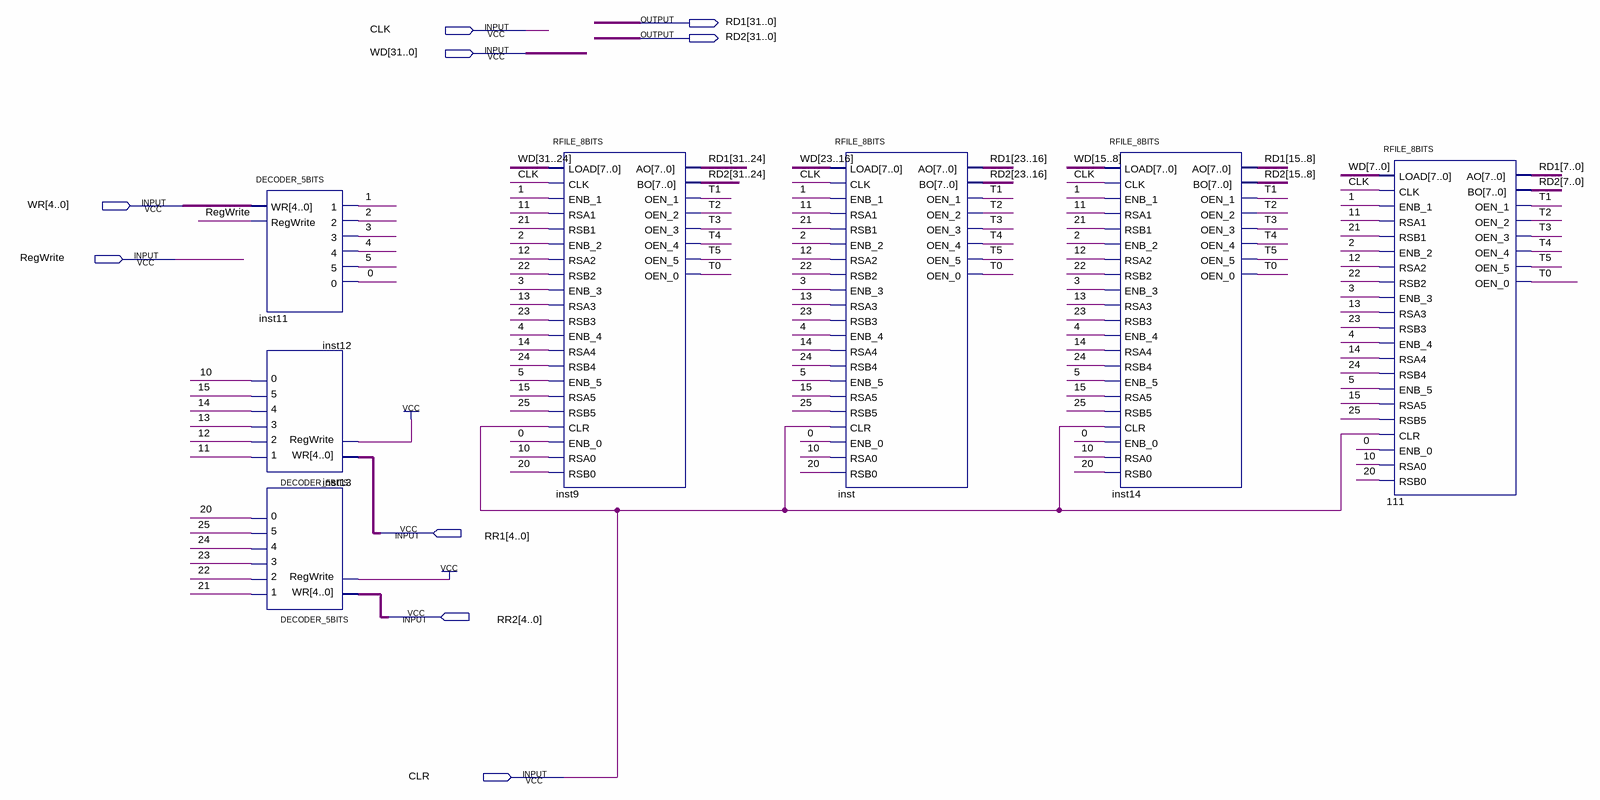
[diagram p0: schematic sheet]
// Quartus schematic full_register_file.bdf as structural Verilog: 7 symbols, 9 pins
module full_register_file (
  input  CLK,
  input  [31:0] WD,
  input  [4:0] WR,
  input  RegWrite,
  input  [4:0] RR1,
  input  [4:0] RR2,
  input  CLR,
  output [31:0] RD1,
  output [31:0] RD2
);

  wire \0 , \1 , \2 , \3 , \4 , \5 , \10 , \11 , \12 , \13 , \14 , \15 , \20 , \21 , \22 , \23 , \24 , \25 ,
       T0, T1, T2, T3, T4, T5;

  DECODER_5BITS inst11 (.WR(WR), .RegWrite(RegWrite), .\1 (\1 ), .\2 (\2 ), .\3 (\3 ), .\4 (\4 ), .\5 (\5 ), .\0 (\0 ));
  DECODER_5BITS inst12 (
    .WR(RR1), .RegWrite(1'b1), .\1 (\11 ), .\2 (\12 ), .\3 (\13 ), .\4 (\14 ), .\5 (\15 ), .\0 (\10 ));
  DECODER_5BITS inst13 (
    .WR(RR2), .RegWrite(1'b1), .\1 (\21 ), .\2 (\22 ), .\3 (\23 ), .\4 (\24 ), .\5 (\25 ), .\0 (\20 ));
  RFILE_8BITS inst9 (
    .LOAD(WD[31:24]), .CLK(CLK), .ENB_1(\1 ), .RSA1(\11 ), .RSB1(\21 ), .ENB_2(\2 ), .RSA2(\12 ),
    .RSB2(\22 ), .ENB_3(\3 ), .RSA3(\13 ), .RSB3(\23 ), .ENB_4(\4 ), .RSA4(\14 ), .RSB4(\24 ), .ENB_5(\5 ),
    .RSA5(\15 ), .RSB5(\25 ), .CLR(CLR), .ENB_0(\0 ), .RSA0(\10 ), .RSB0(\20 ), .AO(RD1[31:24]),
    .BO(RD2[31:24]), .OEN_1(T1), .OEN_2(T2), .OEN_3(T3), .OEN_4(T4), .OEN_5(T5), .OEN_0(T0));
  RFILE_8BITS inst (
    .LOAD(WD[23:16]), .CLK(CLK), .ENB_1(\1 ), .RSA1(\11 ), .RSB1(\21 ), .ENB_2(\2 ), .RSA2(\12 ),
    .RSB2(\22 ), .ENB_3(\3 ), .RSA3(\13 ), .RSB3(\23 ), .ENB_4(\4 ), .RSA4(\14 ), .RSB4(\24 ), .ENB_5(\5 ),
    .RSA5(\15 ), .RSB5(\25 ), .CLR(CLR), .ENB_0(\0 ), .RSA0(\10 ), .RSB0(\20 ), .AO(RD1[23:16]),
    .BO(RD2[23:16]), .OEN_1(T1), .OEN_2(T2), .OEN_3(T3), .OEN_4(T4), .OEN_5(T5), .OEN_0(T0));
  RFILE_8BITS inst14 (
    .LOAD(WD[15:8]), .CLK(CLK), .ENB_1(\1 ), .RSA1(\11 ), .RSB1(\21 ), .ENB_2(\2 ), .RSA2(\12 ), .RSB2(\22 ),
    .ENB_3(\3 ), .RSA3(\13 ), .RSB3(\23 ), .ENB_4(\4 ), .RSA4(\14 ), .RSB4(\24 ), .ENB_5(\5 ), .RSA5(\15 ),
    .RSB5(\25 ), .CLR(CLR), .ENB_0(\0 ), .RSA0(\10 ), .RSB0(\20 ), .AO(RD1[15:8]), .BO(RD2[15:8]),
    .OEN_1(T1), .OEN_2(T2), .OEN_3(T3), .OEN_4(T4), .OEN_5(T5), .OEN_0(T0));
  RFILE_8BITS u_111 (
    .LOAD(WD[7:0]), .CLK(CLK), .ENB_1(\1 ), .RSA1(\11 ), .RSB1(\21 ), .ENB_2(\2 ), .RSA2(\12 ), .RSB2(\22 ),
    .ENB_3(\3 ), .RSA3(\13 ), .RSB3(\23 ), .ENB_4(\4 ), .RSA4(\14 ), .RSB4(\24 ), .ENB_5(\5 ), .RSA5(\15 ),
    .RSB5(\25 ), .CLR(CLR), .ENB_0(\0 ), .RSA0(\10 ), .RSB0(\20 ), .AO(RD1[7:0]), .BO(RD2[7:0]), .OEN_1(T1),
    .OEN_2(T2), .OEN_3(T3), .OEN_4(T4), .OEN_5(T5), .OEN_0(T0));
endmodule
